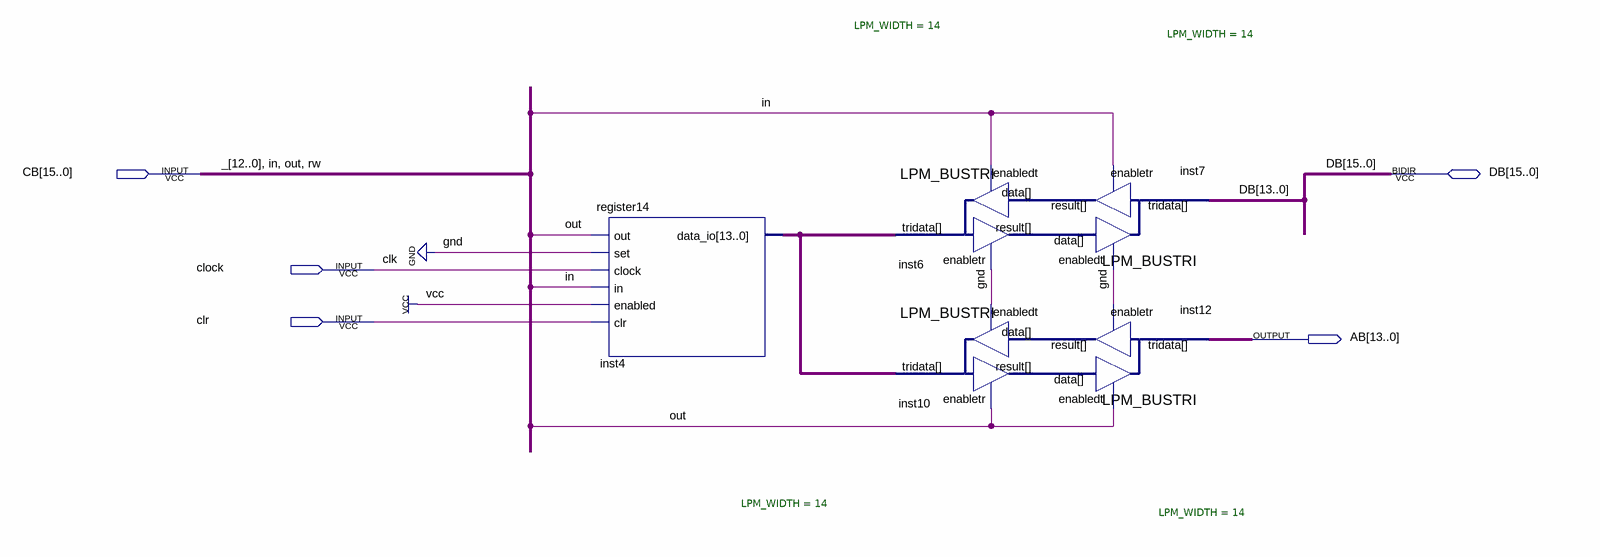
[diagram p0: schematic sheet]
// Quartus schematic address_register.bdf as structural Verilog: 5 symbols, 5 pins
module address_register (
  input  [15:0] CB,
  input  clock,
  input  clr,
  inout  [15:0] DB,
  output [13:0] AB
);

  wire [13:0] inst4_data_io, inst6_result, inst7_result, inst10_result, inst12_result;

  register14 inst4 (
    .out(CB[1]), .set(1'b0), .clock(clock), .in(CB[2]), .enabled(1'b1), .clr(clr), .data_io(inst4_data_io));
  LPM_BUSTRI #(.LPM_WIDTH(14)) inst6 (
    .data(inst7_result), .enabledt(CB[2]), .enabletr(1'b0), .result(inst6_result), .tridata(inst4_data_io));
  LPM_BUSTRI #(.LPM_WIDTH(14)) inst10 (
    .data(inst12_result), .enabledt(1'b0), .enabletr(CB[1]), .result(inst10_result), .tridata(inst4_data_io));
  LPM_BUSTRI #(.LPM_WIDTH(14)) inst7 (
    .data(inst6_result), .enabledt(1'b0), .enabletr(CB[2]), .result(inst7_result), .tridata(DB[13:0]));
  LPM_BUSTRI #(.LPM_WIDTH(14)) inst12 (
    .data(inst10_result), .enabledt(CB[1]), .enabletr(1'b0), .result(inst12_result), .tridata(AB));

  // Other names for the same wires on the sheet: _[12:0] = CB[15:3]; clk = clock; in = CB[2]; out = CB[1]; rw = CB[0]
endmodule
